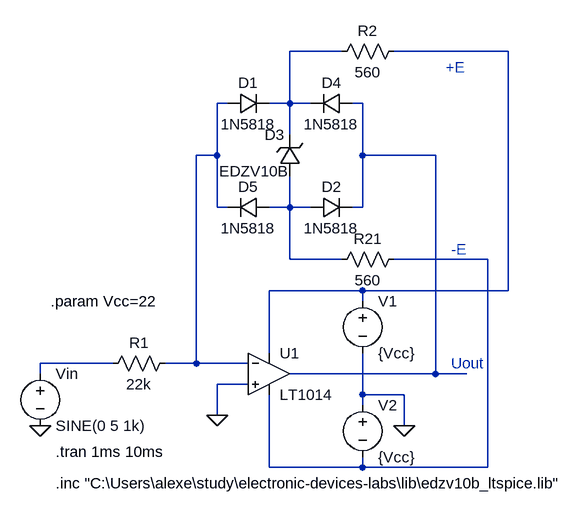
[diagram p0: schematic scheme13.asc]
scheme13.asc, the LTspice schematic file:
Version 4.1
SHEET 1 880 680
WIRE 240 -272 160 -272
WIRE 496 -272 320 -272
WIRE 64 -192 48 -192
WIRE 160 -192 160 -272
WIRE 160 -192 128 -192
WIRE 192 -192 160 -192
WIRE 272 -192 256 -192
WIRE 160 -144 160 -192
WIRE 48 -112 48 -192
WIRE 48 -112 16 -112
WIRE 272 -112 272 -192
WIRE 384 -112 272 -112
WIRE 48 -32 48 -112
WIRE 64 -32 48 -32
WIRE 160 -32 160 -80
WIRE 160 -32 128 -32
WIRE 192 -32 160 -32
WIRE 272 -32 272 -112
WIRE 272 -32 256 -32
WIRE 160 48 160 -32
WIRE 240 48 160 48
WIRE 464 48 320 48
WIRE 272 96 128 96
WIRE 496 96 496 -272
WIRE 496 96 272 96
WIRE 272 112 272 96
WIRE 128 192 128 96
WIRE -112 208 -224 208
WIRE 16 208 16 -112
WIRE 16 208 -32 208
WIRE 96 208 16 208
WIRE -224 224 -224 208
WIRE 384 224 384 -112
WIRE 384 224 160 224
WIRE 432 224 384 224
WIRE 96 240 48 240
WIRE 272 256 272 192
WIRE 336 256 272 256
WIRE 272 272 272 256
WIRE 48 288 48 240
WIRE 336 304 336 256
WIRE 128 368 128 256
WIRE 272 368 272 352
WIRE 272 368 128 368
WIRE 464 368 464 48
WIRE 464 368 272 368
FLAG 48 288 0
FLAG -224 304 0
FLAG 336 304 0
SYMBOL res -16 192 R90
WINDOW 0 0 56 VBottom 2
WINDOW 3 32 56 VTop 2
SYMATTR InstName R1
SYMATTR Value 22k
SYMBOL OpAmps\\LT1014 128 160 R0
SYMATTR InstName U1
SYMBOL voltage -224 208 R0
SYMATTR InstName Vin
SYMATTR Value SINE(0 5 1k)
SYMBOL voltage 272 96 R0
SYMATTR InstName V1
SYMATTR Value {Vcc}
SYMBOL voltage 272 256 R0
SYMATTR InstName V2
SYMATTR Value {Vcc}
SYMBOL diode 64 -176 R270
WINDOW 0 32 32 VTop 2
WINDOW 3 0 32 VBottom 2
SYMATTR InstName D1
SYMATTR Value 1N5818
SYMBOL diode 192 -16 R270
WINDOW 0 32 32 VTop 2
WINDOW 3 0 32 VBottom 2
SYMATTR InstName D2
SYMATTR Value 1N5818
SYMBOL diode 256 -208 R90
WINDOW 0 0 32 VBottom 2
WINDOW 3 32 32 VTop 2
SYMATTR InstName D4
SYMATTR Value 1N5818
SYMBOL diode 128 -48 R90
WINDOW 0 0 32 VBottom 2
WINDOW 3 32 32 VTop 2
SYMATTR InstName D5
SYMATTR Value 1N5818
SYMBOL res 336 -288 R90
WINDOW 0 0 56 VBottom 2
WINDOW 3 32 56 VTop 2
SYMATTR InstName R2
SYMATTR Value 560
SYMBOL res 336 32 R90
WINDOW 0 0 56 VBottom 2
WINDOW 3 32 56 VTop 2
SYMATTR InstName R21
SYMATTR Value 560
SYMBOL zener 176 -80 R180
WINDOW 0 24 64 Left 2
WINDOW 3 18 8 Left 2
SYMATTR InstName D3
SYMATTR Value EDZV10B
TEXT 400 -248 Left 2 ;+E
TEXT 408 32 Left 2 ;-E
TEXT 408 208 Left 2 ;Uout
TEXT -208 112 Left 2 !.param Vcc=22
TEXT -200 344 Left 2 !.tran 1ms 10ms
TEXT -200 392 Left 2 !.inc "C:\\Users\\alexe\\study\\electronic-devices-labs\\lib\\edzv10b_ltspice.lib"

The netlist it stands for:
* scheme13.asc
R1 N003 N007 22k
X§U1 0 N003 N002 N006 N004 LT1014  ; pins In+ In- V+ V- OUT
Vin N007 0 SINE(0 5 1k)
V1 N002 0 {Vcc}
V2 0 N006 {Vcc}
D1 N003 N001 1N5818
D2 N005 N004 1N5818
D4 N004 N001 1N5818
D5 N005 N003 1N5818
R2 N002 N001 560
R21 N006 N005 560
D3 N005 N001 EDZV10B
.model D D
.lib standard.dio
* +E
* -E
* Uout
.param Vcc=22
.tran 1ms 10ms
.inc "C:\Users\alexe\study\electronic-devices-labs\lib\edzv10b_ltspice.lib"
.backanno
.end